# Altium schematic sheet Power.SchDoc: Power
size A4; DrawnBy: Badr B.; Engineer: Badr B.; Revision: 1.0; SheetNumber: 2; SheetTotal: 7
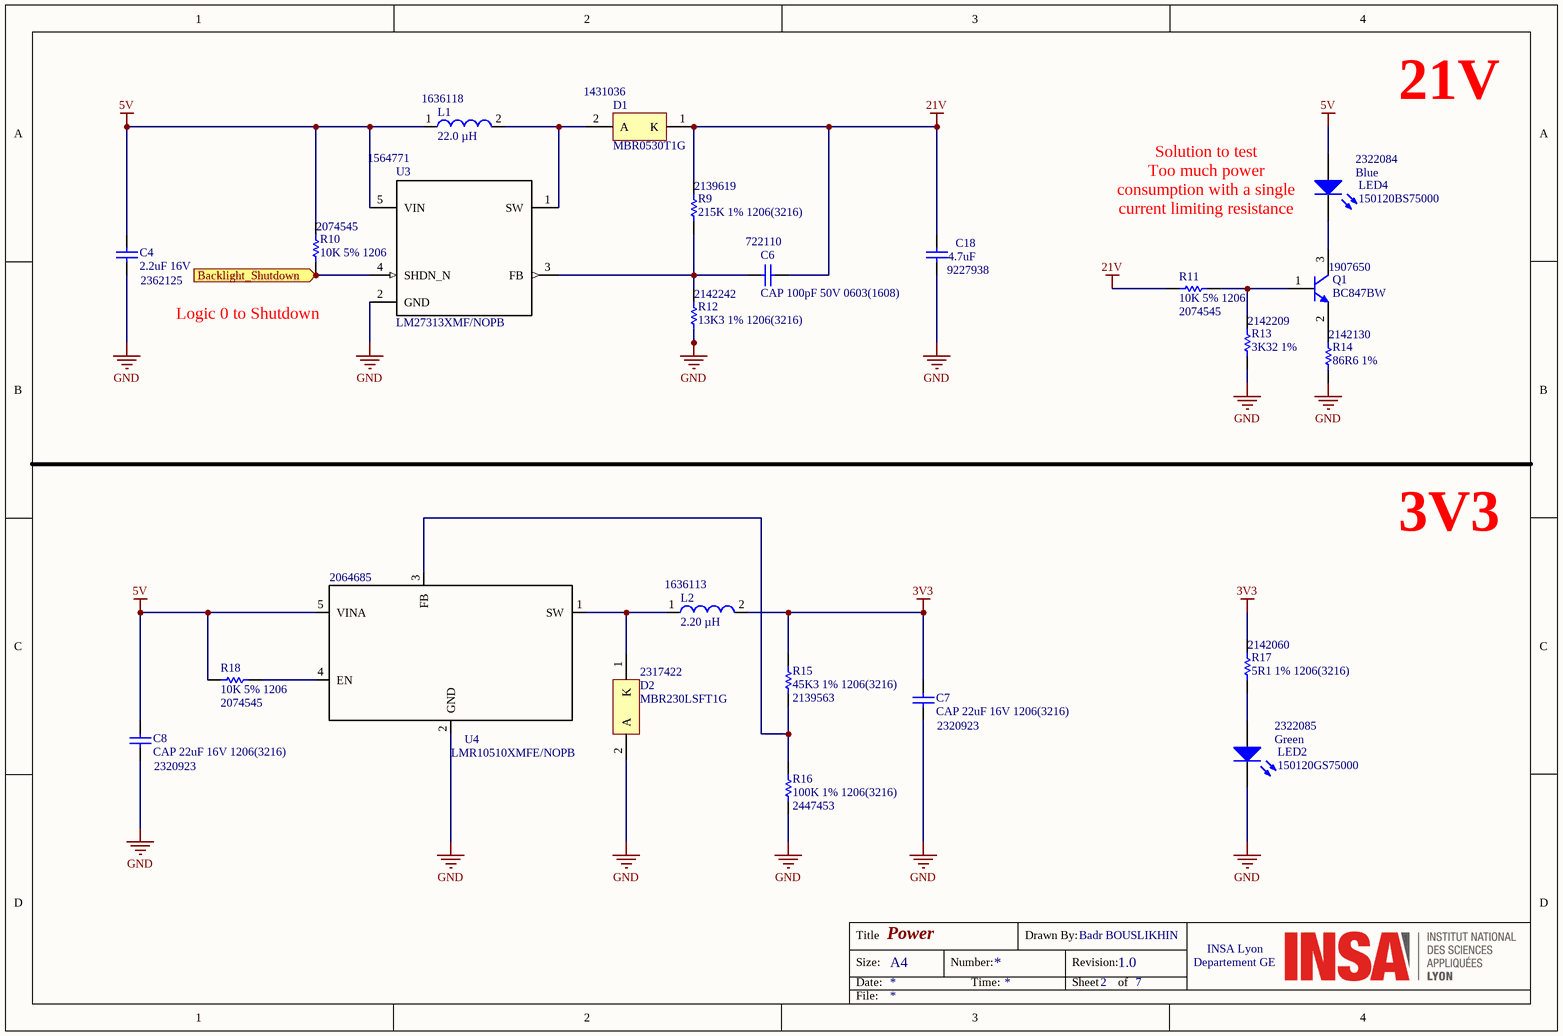
[diagram p0: Power.SchDoc]

## Parts
C4  2.2uF 16V  Supplier Part Number 1: 2362125  [CAPC1206(3216)190_L]
C6  CAP 100pF 50V 0603(1608)  Supplier Part Number 1: 722110  [CAPC0603(1608)100_L]
C7  CAP 22uF 16V 1206(3216)  Supplier Part Number 1: 2320923  [CAPC1206(3216)190_N]
C8  CAP 22uF 16V 1206(3216)  Supplier Part Number 1: 2320923  [CAPC1206(3216)190_N]
C18  4.7uF  Supplier Part Number 1: 9227938  [CAPC1206(3216)190_N]
D1  MBR0530T1G  Supplier Part Number 1: 1431036  [ONSC-SOD-123-2-425-04_V]
D2  MBR230LSFT1G  Supplier Part Number 1: 2317422  [ONSC-SOD-123FL-2-498-01_V]
L1  22.0 µH  Supplier Part Number 1: 1636118  [WE-PD4-S]
L2  2.20 µH  Supplier Part Number 1: 1636113  [WE-PD4-S]
LED2  150120GS75000  Color: Green  Supplier Part Number 1: 2322085  [1206_A]
LED4  150120BS75000  Color: Blue  Supplier Part Number 1: 2322084  [1206_A]
Q1  BC847BW  Supplier Part Number 1: 1907650  [INF-SOT323_N]
R9  215K 1% 1206(3216)  Supplier Part Number 1: 2139619  [RESC1206(3216)_M]
R10  10K 5% 1206  Supplier Part Number 1: 2074545  [RESC1206(3216)_M]
R11  10K 5% 1206  Supplier Part Number 1: 2074545  [RESC1206(3216)_M]
R12  13K3 1% 1206(3216)  Supplier Part Number 1: 2142242  [RESC1206(3216)_L]
R13  3K32 1%  Supplier Part Number 1: 2142209  [RESC1206(3216)_L]
R14  86R6 1%  Supplier Part Number 1: 2142130  [RESC1206(3216)_N]
R15  45K3 1% 1206(3216)  Supplier Part Number 1: 2139563  [RESC1206(3216)_L]
R16  100K 1% 1206(3216)  Supplier Part Number 1: 2447453  [RESC1206(3216)_L]
R17  5R1 1% 1206(3216)  Supplier Part Number 1: 2142060  [RESC1206(3216)_N]
R18  10K 5% 1206  Supplier Part Number 1: 2074545  [RESC1206(3216)_M]
U3  LM27313XMF/NOPB  Supplier Part Number 1: 1564771  [DBV0005A]
U4  LMR10510XMFE/NOPB  Supplier Part Number 1: 2064685  [DBV0005A]

## Ports
Backlight_Shutdown (in)

## Nets
3V3: C7.2 L2.2 R15.1 R17.2
5V: C4.2 C8.2 L1.1 LED4.2(A) R10.2 R18.2 U3.5(VIN) U4.5(VINA)
21V: C6.2 C18.2 D1.1(K) R9.2 R11.2
GND: C4.1 C7.1 C8.1 C18.1 D2.2(A) LED2.1(K) R12.1 R13.1 R14.1 R16.1 U3.2(GND) U4.2(GND)
Backlight_Shutdown: R10.1 U3.4(SHDN_N) ; port Backlight_Shutdown
NetC6_1: C6.1 R9.1 R12.2 U3.3(FB)
NetD1_2: D1.2(A) L1.2 U3.1(SW)
NetD2_1: D2.1(K) L2.1 U4.1(SW)
NetLED2_2: LED2.2(A) R17.1
NetLED4_1: LED4.1(K) Q1.3(C)
NetQ1_1: Q1.1(B) R11.1 R13.2
NetQ1_2: Q1.2(E) R14.2
NetR15_2: R15.2 R16.2 U4.3(FB)
NetR18_1: R18.1 U4.4(EN)

## Notes on the sheet
- 21V
- Solution to test
  Too much power consumption with a single current limiting resistance
- Logic 0 to Shutdown
- 3V3
- Title
- Size:
- Date:
- A4
- Number:
- Time:
- Drawn By:
- Revision:
- Sheet
- Badr BOUSLIKHIN
- of
- Departement GE
- INSA Lyon
- File:

## Library data of the parts
C4 = CMP-1037-04816-1: CAP 2.2uF 16V ±20% 1206 (3216 Metric) Thickness 1.9mm SMD; Case-EIA: 1206; Case-Metric: 3216; Max Thickness: 1.9 mm; Rated Voltage: 16 V; Tolerance: ±20%; Technology: SMT; Value: 2.2uF; Supplier 1: Farnell
C6 = CMP-1035-01270-1: CAP 100pF 50V ±10% 0603 (1608 Metric) Thickness 1mm SMD; Manufacturer: YAGEO (PHYCOMP); Manufacturer Part Number: CC0603KRX7R9BB101; Case-Metric: 1608; Case-EIA: 0603; Technology: SMT; Value: 100pF; Tolerance: ±10%; Max Thickness: 1 mm; Rated Voltage: 50 V; Supplier 1: Farnell; RoHS: YES; Stock 1: 34249; Pricing 1: 10=0,0621, 100=0,0483, 1000=0,0392, 10000=0,0305 (EUR); ComponentLink1URL: http://www.farnell.com/datasheets/1734573.pdf; ComponentLink1Description: http://www.farnell.com/datasheets/1734573.pdf; ComponentLink2URL: http://www.farnell.com/cad/1555016.zip; ComponentLink2Description: http://www.farnell.com/cad/1555016.zip
C7 C8 = CMP-1037-04992-1: CAP 22uF 16V ±10% 1206 (3216 Metric) Thickness 1.9mm SMD; Case-EIA: 1206; Case-Metric: 3216; Rated Voltage: 16 V; Technology: SMT; Value: 22uF; Max Thickness: 1.9 mm; Tolerance: ±10%; Supplier 1: Farnell
C18 = CMP-1037-04923-1: CAP 4.7uF 50V ±10% 1206 (3216 Metric) Thickness 1.9mm SMD; Case-EIA: 1206; Case-Metric: 3216; Technology: SMT; Rated Voltage: 50 V; Max Thickness: 1.9 mm; Value: 4.7uF; Tolerance: ±10%; Supplier 1: Farnell
D1 = CMP-1055-00413-1: Schottky Power Rectifier, 2-Pin SOD-123, Pb-Free, Tape and Reel; Manufacturer: On Semiconductor; IFSM Max (A): 5.5; Configuration: Single; PackageVersion: Rev. G, 10/2009; ComponentLink2URL: http://www.onsemi.cn/pub_link/Collateral/MBR0530T1-D.PDF; Packing: Tape and Reel; RoHS: TRUE; ComponentLink1URL: http://www.onsemi.com/; Mounting Technology: Surface Mount; ComponentLink3URL: http://www.onsemi.com/pub_link/Collateral/425-04.PDF; ComponentLink3Description: Package Specification; PartNumber: MBR0530T1G; PackageDescription: 2-Pin SOD, Body 1.6 x 2.69 mm; DatasheetVersion: Rev. 7; PackageReference: SOD-123-2-425-04; ComponentLink1Description: Manufacturer URL; ComponentLink2Description: Datasheet; Supplier 1: Farnell
D2 = CMP-1055-00442-1: Schottky Power Rectifier, 2-Pin SOD-123, Pb-Free, Tape and Reel; Manufacturer: On Semiconductor; Configuration: Single; IFSM Max (A): 40; ComponentLink2Description: Datasheet; DatasheetVersion: Rev. 0; ComponentLink1URL: http://www.onsemi.com/; ComponentLink2URL: http://www.onsemi.cn/pub_link/Collateral/MBR230LSFT1G.PDF; ComponentLink3Description: Package Specification; PackageDescription: 2-Pin SOD, Body 1.65 x 2.7 mm; RoHS: TRUE; PackageVersion: Rev. A; Mounting Technology: Surface Mount; ComponentLink3URL: http://www.onsemi.cn/pub_link/Collateral/MBR120VLSFT1-D.PDF; ComponentLink1Description: Manufacturer URL; Packing: Tape and Reel; PackageReference: SOD-123FL-2-498-01; PartNumber: MBR230LSFT1G; Supplier 1: Farnell
L1 = CMP-0227-00739-1: SMD-Power Inductor WE-PD4, L = 22.0 µH; ComponentLink2Description: Datasheet; ComponentLink2URL: http://www.we-online.de/katalog/media/pdf/74455122.pdf; ComponentLink1URL: http://www.we-online.com; Inductance: 22.0 µH; PackageReference: WE-PD4-S; DatasheetVersion: ver 2, Feb-2009; PackageVersion: 2009; PackageDescription: SMD Inductor, 2-Leads, Body 6.6 x 4.45 mm; ComponentLink1Description: Manufacturer Link; Supplier 1: Farnell
L2 = CMP-0227-00671-1: SMD-Power Inductor WE-PD4, L = 2.20 µH; Manufacturer: WURTH ELEKTRONIK; Manufacturer Part Number: 74455022; Gamme de produit: Série WE-PD4; Tolérance d'Inductance: ± 20%; Construction inductance: Non blindé; Résistance DC max.: 0.07; Courant efficace (Irms): 2.4; Courant de Saturation (Isat): 2.3; Boîtier Inducteur de Puissance: 6.6mm x 4.45mm x 2.92; Type de packaging: Bande découpée; SVHC: No SVHC (17-Dec-2014); Fréquence de résonance: 90; Nombre de broches: 2; Type d'inductance: De puissance<!--FANDB--><div class="features-and-benefits-container"></div>; PackageDescription: SMD Inductor, 2-Leads, Body 6.6 x 4.45 mm; ComponentLink2URL: http://www.we-online.de/katalog/media/pdf/74455022.pdf; PackageReference: WE-PD4-S; ComponentLink1URL: http://www.we-online.com; ComponentLink2Description: Datasheet; Inductance: 2.20 µH; PackageVersion: 2009; ComponentLink1Description: Manufacturer Link; DatasheetVersion: ver 2, Feb-2009; Supplier 1: Farnell; RoHS: YES; Stock 1: 204; Pricing 1: 1=2,16, 10=2,01, 50=1,81, 100=1,73, 300=1,67, 600=1,63 (EUR); Fréquence de résonance: 90; Série: WE-PD4; ComponentLink3URL: http://www.farnell.com/datasheets/1735973.pdf; ComponentLink3Description: http://www.farnell.com/datasheets/1735973.pdf; ComponentLink4URL: http://www.farnell.com/cad/1670112.zip; ComponentLink4Description: http://www.farnell.com/cad/1670112.zip
LED2 = CMP-1426-00014-1: SMD mono-color Chip LED, WL-SMCW, Green; Manufacturer: Wuerth Elektronik; PackageReference: 1206_A; PartNumber: 150120GS75000; ComponentLink1Description: Manufacturer URL; ComponentLink2URL: http://katalog.we-online.com/led/datasheet/150120GS75000.pdf; ComponentLink2Description: Datasheet; ComponentLink1URL: http://www.we-online.com; Supplier 1: Farnell
LED4 = CMP-1426-00015-1: SMD mono-color Chip LED, WL-SMCW, Blue; Manufacturer: Wuerth Elektronik; ComponentLink2Description: Datasheet; ComponentLink1URL: http://www.we-online.com; PartNumber: 150120BS75000; ComponentLink1Description: Manufacturer URL; ComponentLink2URL: http://katalog.we-online.com/led/datasheet/150120BS75000.pdf; PackageReference: 1206_A; Supplier 1: Farnell
Q1 = CMP-1177-00080-1: NPN Silicon AF Transistor, 45 V VCEO, 100 mA IC, SOT323, Reel, Green; Manufacturer: Infineon; VCEO (max): 45 V; ICBO (max): 15 nA; IBM (max): 200 mA; Ptot (max): 250 mW; Green: TRUE; VEBO (max): 6 V; IC (max): 100 mA; VCBO (max): 50 V; fT (typ): 250 MHz; Halogen-free: TRUE; Packing: Reel; Mounting Technology: Surface Mount; PackageReference: SOT323; PartNumber: BC847BW; PackageDescription: 3-Pin Small Outline Transistor Package, 1.25 x 2 mm Body, 0.65 mm Pitch; ICM (max): 200 mA; ComponentLink3Description: Package Specification; ComponentLink1URL: http://www.infineon.com/; ComponentLink2Description: Datasheet; Polarity: NPN; ComponentLink2URL: http://www.infineon.com/dgdl/bc847series_bc848series_bc849series_bc850series.pdf?folderId=db3a304314dca389011541d30fa21656&fileId=db3a304314dca389011541d4630a1657; ComponentLink1Description: Manufacturer URL; ComponentLink3URL: http://www.infineon.com/dgdl/SOT323-Package_Overview.pdf?folderId=db3a30431936bc4b0119533e1dcb3c92&fileId=db3a30431936bc4b011953495f283cb1; Supplier 1: Farnell
R9 = CMP-1014-00771-1: 215K 0.25W 1% 1206 (3216 Metric)  SMD; Manufacturer: VISHAY DRALORIC; Manufacturer Part Number: CRCW1206215KFKEA; Value: 215000.00 Ohm; Case-EIA: 1206; Case-Metric: 3216; Gamme de produit: Série AEC-Q200 CRCW; Résistance: 215; Puissance: 250; Tension: 200; Type de boîtier de résistance: 1206 [3216 Metric]; Type de packaging: Bande découpée; Type de résistance: Couche épaisse; Coefficient de température: ± 100; SVHC: No SVHC (17-Dec-2014); Montage de résistance: CMS<!--FANDB--><div class="features-and-benefits-container"></div>; Tolerance: 1 %; Power: 0.25 W; Technology: SMT; Supplier 1: Farnell; RoHS: Y-EX; Stock 1: 3650; Pricing 1: 50=0,016, 250=0,0127, 500=0,01, 1000=0,0084 (EUR); Tolérance de résistance: ± 1%; MSL: MSL 1 - Illimité; ComponentLink1URL: http://www.farnell.com/datasheets/1697337.pdf; ComponentLink1Description: http://www.farnell.com/datasheets/1697337.pdf
R10 R11 R18 = CMP-1014-00098-1: 10K 0.25W 5% 1206 (3216 Metric)  SMD; Manufacturer: YAGEO (PHYCOMP); Manufacturer Part Number: RC1206JR-0710KL; Value: 10000.00 Ohm; Case-Metric: 3216; Case-EIA: 1206; Power: 0.25 W; Tolerance: 5 %; Technology: SMT; RoHS: YES; ComponentLink1URL: http://www.farnell.com/datasheets/444357.pdf; ComponentLink1Description: http://www.farnell.com/datasheets/444357.pdf; ComponentLink2URL: http://www.farnell.com/cad/1539272.zip; ComponentLink2Description: http://www.farnell.com/cad/1539272.zip; Supplier 1: Farnell
R12 = CMP-1014-00636-1: 13K3 0.25W 1% 1206 (3216 Metric)  SMD; Manufacturer: VISHAY DRALORIC; Manufacturer Part Number: CRCW120613K3FKEA; Value: 13300.00 Ohm; Case-Metric: 3216; Case-EIA: 1206; Tolerance: 1 %; Technology: SMT; Power: 0.25 W; RoHS: Y-EX; ComponentLink1URL: http://www.farnell.com/datasheets/1697337.pdf; ComponentLink1Description: http://www.farnell.com/datasheets/1697337.pdf; ComponentLink2URL: http://www.farnell.com/cad/1553262.zip; ComponentLink2Description: http://www.farnell.com/cad/1553262.zip; Supplier 1: Farnell
R13 = CMP-1014-00568-1: 3K32 0.25W 1% 1206 (3216 Metric)  SMD; Case-EIA: 1206; Case-Metric: 3216; Value: 3320.00 Ohm; Tolerance: 1 %; Technology: SMT; Power: 0.25 W; Supplier 1: Farnell
R14 = CMP-1014-00390-1: 86R6 0.25W 1% 1206 (3216 Metric)  SMD; Case-EIA: 1206; Case-Metric: 3216; Value: 86.60 Ohm; Tolerance: 1 %; Technology: SMT; Power: 0.25 W; Supplier 1: Farnell
R15 = CMP-1014-00697-1: 45K3 0.25W 1% 1206 (3216 Metric)  SMD; Manufacturer: VISHAY DRALORIC; Manufacturer Part Number: CRCW120645K3FKEA; Case-EIA: 1206; Case-Metric: 3216; Value: 45300.00 Ohm; Tolerance: 1 %; Technology: SMT; Power: 0.25 W; Supplier 1: Farnell; RoHS: Y-EX; Stock 1: 8000; Pricing 1: 50=0,014, 250=0,0135, 500=0,0099, 1000=0,0084 (EUR); ComponentLink1URL: http://www.farnell.com/datasheets/1697337.pdf; ComponentLink1Description: http://www.farnell.com/datasheets/1697337.pdf
R16 = CMP-1014-00736-1: 100K 0.25W 1% 1206 (3216 Metric)  SMD; Manufacturer: YAGEO (PHYCOMP); Manufacturer Part Number: RC1206FR-07100KL; Case-EIA: 1206; Value: 100000.00 Ohm; Case-Metric: 3216; Tolerance: 1 %; Power: 0.25 W; Technology: SMT; RoHS: YES; ComponentLink1URL: http://www.farnell.com/datasheets/444357.pdf; ComponentLink1Description: http://www.farnell.com/datasheets/444357.pdf; Supplier 1: Farnell
R17 = CMP-1014-00251-1: 5R1 0.25W 1% 1206 (3216 Metric)  SMD; Value: 5.10 Ohm; Case-EIA: 1206; Case-Metric: 3216; Tolerance: 1 %; Technology: SMT; Power: 0.25 W; Supplier 1: Farnell
U3 = LM27313XMF/NOPB: Imported; PartNumber: LM27313XQMF/NOPB; Manufacturer: Texas Instruments; CompType: IC; PIN_COUNT: 5; PackageReference: DBV0005A; MountType: SMT; RoHS: Y; Manufacturer_Part_Number: LM27313XMF/NOPB; Manufacturer_Name: Texas Instruments; RefDes: RefDes; Type: DEV; Value: Value; Supplier 1: Farnell
U4 = LMR10510XMFE/NOPB: Imported; Frequency: 3000000.0; Imax: 1.0; Mktg_Package: NA; Vendor: Texas Instruments; Tension, entrée min.: 3; Tension, entrée max..: 5.5; Nombre de canaux de sortie: 1; Boîtier de convertisseur DC / DC: SOT-23; Nombre de broches: 5; Tension, sortie min.: 600; Tension, sortie max..: 4.5; Fréquence de commutation: 1.6; Topologie: Buck (Abaisseur); Température de fonctionnement max..: 125; Type de packaging: Bande découpée; SVHC: No SVHC (17-Dec-2014); Température de fonctionnement: -40°C à +125; Température d'utilisation min: -40; Datasheet URL: http://www.ti.com/product/lmr10510; Package: NA; NSID: LMR10510XMFE/NOPB; Manufacturer_Part_Number: LMR10510XMFE/NOPB; Manufacturer_Name: Texas Instruments; RefDes: RefDes; Type: DEV; Value: Value; Supplier 1: Farnell; Manufacturer: TEXAS INSTRUMENTS; Manufacturer Part Number: LMR10510XMF; RoHS: YES; Stock 1: 917; Pricing 1: 1=1,03, 10=0,692, 100=0,579, 250=0,503, 500=0,455, 1000=0,409, 4000=0,361, 10000=0,324 (EUR); Courant, sortie: 1; MSL: MSL 1 - Illimité; Tension d'entrée primaire: 5.5; Tension, sortie: 4.5; ComponentLink1URL: http://www.farnell.com/simulation/1745330.zip; ComponentLink1Description: http://www.farnell.com/simulation/1745330.zip; ComponentLink2URL: http://www.farnell.com/datasheets/1503732.pdf; ComponentLink2Description: http://www.farnell.com/datasheets/1503732.pdf; ComponentLink3URL: http://www.farnell.com/cad/1757176.zip; ComponentLink3Description: http://www.farnell.com/cad/1757176.zip